# Altium schematic sheet MM_Motor_Driver.SchDoc
size A; SheetNumber: 3; SheetTotal: 4
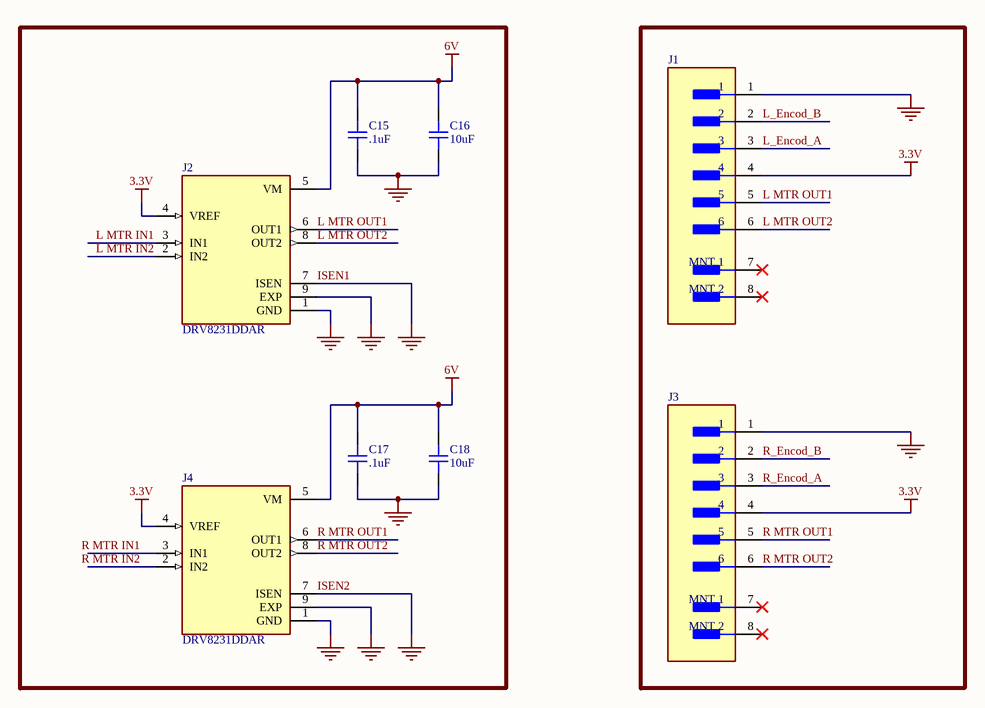
[diagram p0: MM_Motor_Driver.SchDoc]

## Parts
C15  .1uF  [CAP_0603]
C16  10uF  [CAP_0603]
C17  .1uF  [CAP_0603]
C18  10uF  [CAP_0603]
J1  BM06B-SRSS-TBT(LF)(SN)  [FP-BM06B-SRSS-TBT_LF_SN-MFG]  (value not drawn)
J2  DRV8231DDAR  [IC_DRV8231DDAR]
J3  BM06B-SRSS-TBT(LF)(SN)  [FP-BM06B-SRSS-TBT_LF_SN-MFG]  (value not drawn)
J4  DRV8231DDAR  [IC_DRV8231DDAR]

## Nets
3.3V: J1.4 J2.4(VREF) J3.4 J4.4(VREF)
6V: C15.2 C16.2 C17.2 C18.2 J2.5(VM) J4.5(VM)
ISEN1: C15.1 C16.1 C17.1 C18.1 J1.1 J2.1(GND) J2.7(ISEN) J2.9(EXP) J3.1 J4.1(GND) J4.7(ISEN) J4.9(EXP)  [also labelled GND, ISEN2]
L MTR IN1: J2.3(IN1)
L MTR IN2: J2.2(IN2)
L MTR OUT1: J1.5 J2.6(OUT1)
L MTR OUT2: J1.6 J2.8(OUT2)
L_Encod_A: J1.3
L_Encod_B: J1.2
R MTR IN1: J4.3(IN1)
R MTR IN2: J4.2(IN2)
R MTR OUT1: J3.5 J4.6(OUT1)
R MTR OUT2: J3.6 J4.8(OUT2)
R_Encod_A: J3.3
R_Encod_B: J3.2

Not connected (* = marked no-connect by the designer): J1 7(MNT_1)* 8(MNT_2)*; J3 7(MNT_1)* 8(MNT_2)*

## Library data of the parts
C15-C18 = CAP_0603: Capacitor SMD 0603; Manufacturer: *; Manufacturer Part Number: *; Distributor Link: *; LCSC: *; Rating: *; Dielectric: *
J1 J3 = CMP-17439-000255-1: CONN HEADER SMD 6POS 1MM; Voltage Rating: 50V; Number of Positions: 6; Current Rating: 1A; Gender: Male; Contact Resistance: 20mR; Insulation Resistance: 100MR; Mated Stacking Heights: 4.9mm; Number of Rows: 1; Contact Type: Male Pin; Pitch: 1mm; Length: 8mm; Max Operating Temperature: 85°C; Mount: Surface Mount; Material: Polyamide; Depth: 3.6mm; Housing Color: Natural; Orientation: Straight; Termination: Solder; Package Quantity: 1; Min Operating Temperature: -25°C; Contact Shape: Square; Insulation Color: Natural; Connector Type: Header; Max Voltage Rating (DC): 50V; Insulation Material: Nylon; Flammability Rating: UL94 V-0; Color: Natural; Contact Plating: Tin; Lead Free: Lead Free; Packaging: Tape and Reel; Contact Material: Copper Alloy; Series: SR; Housing Material: Polyamide; Contact Finish - Mating: TIN; Max Voltage Rating (AC): 50V; Fastening Type: Pull; Max Current Rating: 1A
J2 J4 = DRV8231DDAR: 35-V, 3.7-A H-bridge motor driver with integrated current regulation